# Altium project Brushless_motor_driver.PrjPcb
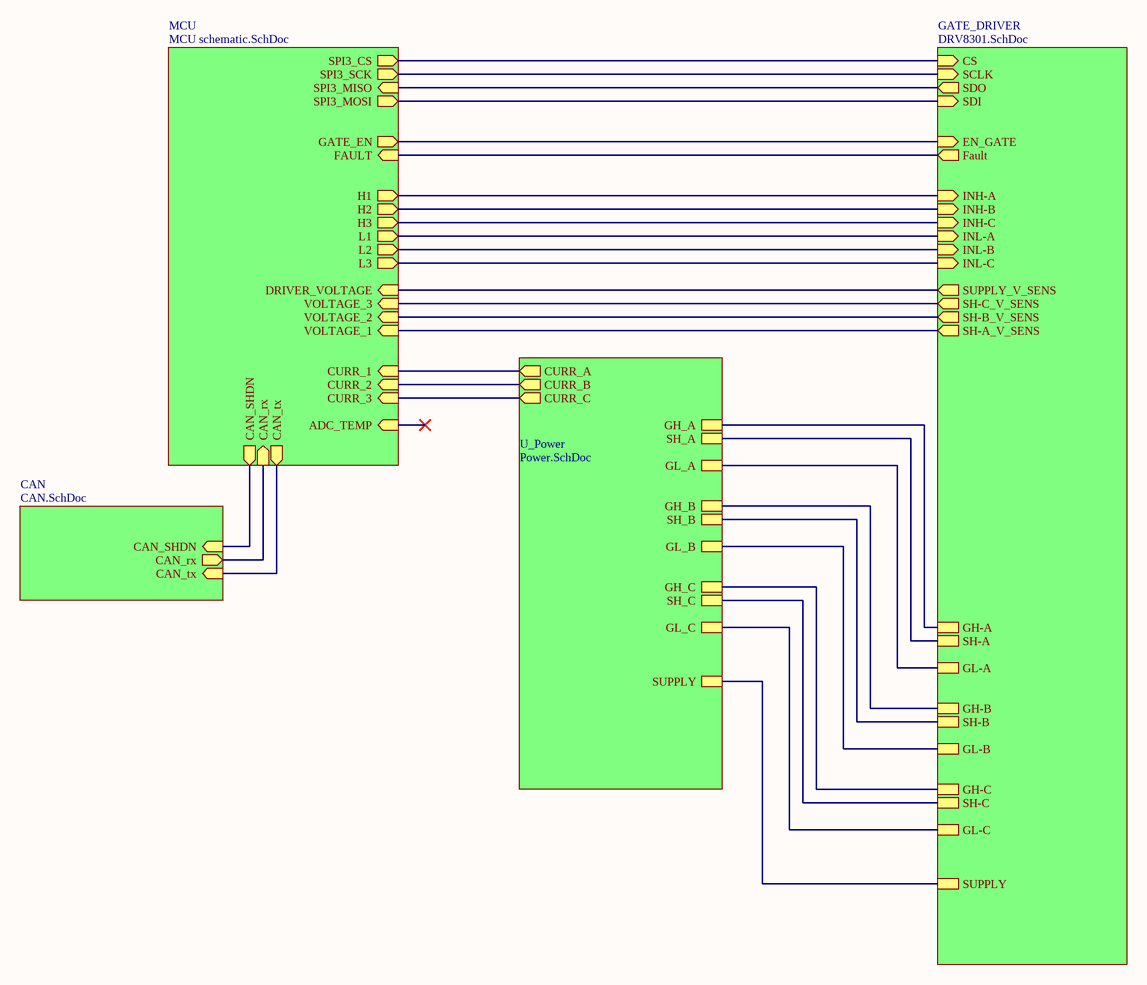
[diagram p0: Top_level.SchDoc]
5 sheets, 115 parts. Net scope: hierarchical (ports join the sheet entries above them; power ports are global).
Board file: brushless_motor_driver_PCB.PcbDoc
Sheets:
  Top_level.SchDoc
    CAN = CAN.SchDoc
    U_Power = Power.SchDoc
    MCU = MCU schematic.SchDoc
    GATE_DRIVER = DRV8301.SchDoc

## Sheet Top_level.SchDoc
size A3; SheetNumber: 1; SheetTotal: 5

### Sub-sheets
CAN = CAN.SchDoc: CAN_tx (in), CAN_rx (out), CAN_SHDN (in)
GATE_DRIVER = DRV8301.SchDoc: Fault (out), CS (in), SDI (in), SDO (out), SCLK (in), EN_GATE (in), INH-A (in), INL-A (in), INH-B (in), INL-B (in), INH-C (in), INL-C (in), SUPPLY, SH-A_V_SENS (out), SH-B_V_SENS (out), SH-C_V_SENS (out), SUPPLY_V_SENS (out), GL-C, GL-A, GH-B, SH-B, GL-B, GH-C, SH-C, GH-A, SH-A
MCU = MCU schematic.SchDoc: CAN_tx (out), CAN_rx (in), SPI3_SCK (out), SPI3_MISO (in), SPI3_MOSI (out), SPI3_CS (out), ADC_TEMP (in), CAN_SHDN (out), GATE_EN (out), FAULT (in), H1 (out), H2 (out), H3 (out), L1 (out), L2 (out), L3 (out), CURR_1 (in), CURR_2 (in), CURR_3 (in), VOLTAGE_1 (in), VOLTAGE_2 (in), VOLTAGE_3 (in), DRIVER_VOLTAGE (in)
U_Power = Power.SchDoc: GH_A, SH_A, GL_A, GH_B, GH_C, GL_B, GL_C, SH_B, SH_C, CURR_A (out), CURR_B (out), CURR_C (out), SUPPLY

### Nets
GH_A_net: sheet U_Power/GH_A, sheet GATE_DRIVER/GH-A
GH_B_net: sheet U_Power/GH_B, sheet GATE_DRIVER/GH-B
GH_C_net: sheet U_Power/GH_C, sheet GATE_DRIVER/GH-C
GL_A_net: sheet U_Power/GL_A, sheet GATE_DRIVER/GL-A
GL_B_net: sheet U_Power/GL_B, sheet GATE_DRIVER/GL-B
GL_C_net: sheet U_Power/GL_C, sheet GATE_DRIVER/GL-C
SPI_CS: sheet MCU/SPI3_CS, sheet GATE_DRIVER/CS
SPI_SCLK: sheet MCU/SPI3_SCK, sheet GATE_DRIVER/SCLK
SPI_SDI: sheet MCU/SPI3_MOSI, sheet GATE_DRIVER/SDI
SPI_SDO: sheet MCU/SPI3_MISO, sheet GATE_DRIVER/SDO
SUPPLY_NET: sheet U_Power/SUPPLY, sheet GATE_DRIVER/SUPPLY
NetC20_2: sheet U_Power/SH_A, sheet GATE_DRIVER/SH-A
NetC21_2: sheet U_Power/SH_B, sheet GATE_DRIVER/SH-B
NetC22_2: sheet U_Power/SH_C, sheet GATE_DRIVER/SH-C
NetC29_1: sheet U_Power/CURR_A, sheet MCU/CURR_1
NetC30_1: sheet U_Power/CURR_B, sheet MCU/CURR_2
NetC31_1: sheet U_Power/CURR_C, sheet MCU/CURR_3
NetR4_1: sheet CAN/CAN_tx, sheet MCU/CAN_tx
NetR5_1: sheet CAN/CAN_rx, sheet MCU/CAN_rx
NetR8_1: sheet CAN/CAN_SHDN, sheet MCU/CAN_SHDN
NetR13_1: sheet MCU/FAULT, sheet GATE_DRIVER/Fault
NetR24_2: sheet MCU/DRIVER_VOLTAGE, sheet GATE_DRIVER/SUPPLY_V_SENS
NetR26_2: sheet MCU/VOLTAGE_1, sheet GATE_DRIVER/SH-A_V_SENS
NetR28_2: sheet MCU/VOLTAGE_2, sheet GATE_DRIVER/SH-B_V_SENS
NetR30_2: sheet MCU/VOLTAGE_3, sheet GATE_DRIVER/SH-C_V_SENS
NetU1_82: sheet MCU/H1, sheet GATE_DRIVER/INH-A
NetU1_83: sheet MCU/H2, sheet GATE_DRIVER/INH-B
NetU1_84: sheet MCU/H3, sheet GATE_DRIVER/INH-C
NetU1_85: sheet MCU/L1, sheet GATE_DRIVER/INL-A
NetU1_86: sheet MCU/L2, sheet GATE_DRIVER/INL-B
NetU1_87: sheet MCU/L3, sheet GATE_DRIVER/INL-C
NetU1_88: sheet MCU/GATE_EN, sheet GATE_DRIVER/EN_GATE

## Sheet CAN.SchDoc
size A; SheetNumber: 3; SheetTotal: 5
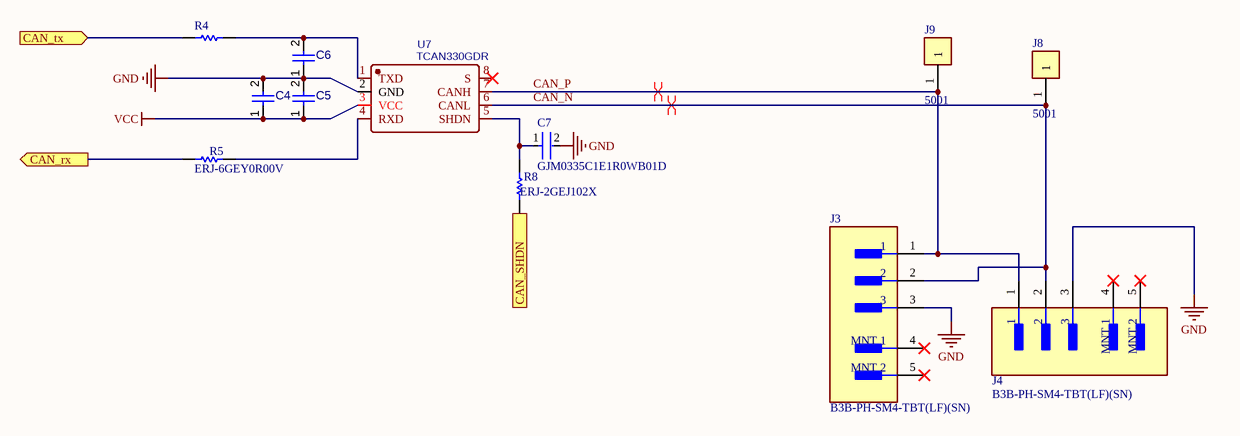
[diagram p1: CAN.SchDoc]

### Parts
C4  KGM15CR71C105JT  [CAP-0603]  (value not drawn)
C5  KGM15CR71C105JT  [CAP-0603]  (value not drawn)
C6  KGM15CR71C105JT  [CAP-0603]  (value not drawn)
C7  GJM0335C1E1R0WB01D  [FP-GJM033-0_03-IPC_A]
J3  B3B-PH-SM4-TBT(LF)(SN)  [FP-B3B-PH-SM4-TBT_LF_SN-MFG]
J4  B3B-PH-SM4-TBT(LF)(SN)  [FP-B3B-PH-SM4-TBT_LF_SN-MFG]
J8  5001  [FP-5001-MFG]
J9  5001  [FP-5001-MFG]
R4  ERJ-6GEY0R00V  [RESC2013X70X40NL20T20]  (value not drawn)
R5  ERJ-6GEY0R00V  [RESC2013X70X40NL20T20]
R8  ERJ-2GEJ102X  [RESC1005X40X25NL05T05]
U7  TCAN330GDR  [IC-BUCK-8SOIC]

### Ports
CAN_rx (out), CAN_SHDN (in), CAN_tx (in)

### Nets
GND: C4.2 C5.2 C6.1 C7.2 J3.3 J4.3 U7.2(GND)
VCC: C4.1 C5.1 U7.3(VCC)
CAN_N: J3.2 J4.2 J8.1 U7.6(CANL)  [project net CAN_N_3]
CAN_P: J3.1 J4.1 J9.1 U7.7(CANH)  [project net CAN_P_3]
NetC6_2: C6.2 R4.2 U7.1(TXD)
NetC7_1: C7.1 R8.2 U7.5(SHDN)
NetR4_1: R4.1 ; port CAN_tx
NetR5_1: R5.1 ; port CAN_rx
NetR5_2: R5.2 U7.4(RXD)
NetR8_1: R8.1 ; port CAN_SHDN

Not connected (* = marked no-connect by the designer): J3 4(MNT_1)* 5(MNT_2)*; J4 4(MNT_1)* 5(MNT_2)*; U7 8(S)*

### Layout directives
differential pair: CAN_N_3, CAN_P_3

### Library data of the parts
C4-C6 = CMP-001-00090-1: Cap Cer 1UF 16V X7R 0603
C7 = CMP-2010-00803-2: Ceramic Capacitor 1pF ±0.05pF 25V C0G 0201 (0603 Metric); Packaging: Tape and Reel; Lead Free: Lead Free; Voltage Rating (DC): 25V; Termination: SMD/SMT; Capacitance: 1pF; Height: 0.3mm; Case Code (Imperial): 0201; Thickness: 0.013inch; Max Operating Temperature: 125°C; Length: 0.6mm; Case/Package: 0201; Voltage Rating: 25V; Case Code (Metric): 0603; Radiation Hardening: No; Width: 0.3mm; Min Operating Temperature: -55°C; Mount: Surface Mount; Package Quantity: 15000; Depth: 0.3mm; Dielectric: C0G
J3 J4 = CMP-17439-000306-1: CONN HEADER SMD 3POS 2MM; Contact Resistance: 20mR; Max Voltage Rating (AC): 100V; Number of Positions: 3; Pitch: 0.079inch; Mated Stacking Heights: 8.6mm; Max Current Rating: 2A; Fastening Type: Detent; Max Operating Temperature: 85°C; Termination: Solder; Mount: Surface Mount; Contact Finish - Mating: TIN; Min Operating Temperature: -25°C; Housing Color: Beige; Packaging: Tape and Reel; Insulation Color: Natural; Length: 9.95mm; Flammability Rating: UL94 V-0; Connector Type: Header; Contact Material: Copper Alloy; Insulation Material: Nylon; Lead Free: Lead Free; Contact Plating: Tin; Contact Shape: Square; Number of Rows: 1; Color: Natural; Package Quantity: 10; Depth: 5mm; Voltage Rating: 100V; Housing Material: Polyamide; Contact Type: Male Pin; Series: PH; Orientation: Straight; Contact Mating Length: 0.13inch
J8 J9 = CMP-2000-05181-2: PC TEST POINT MINIATURE BLACK; Body Material: Bronze; Plating: Silver; Inside Diameter: 1.27mm; Hole Diameter: 1.6mm; Number of Ports: 1; Outside Diameter: 2.54mm; Insulation: Insulated; Insulation Material: Nylon; Mount: Through Hole; RoHS Compliant: Yes; Series: THM; Height: 0.3inch; Termination: Through Hole; Material: Nylon; Packaging: Bulk; Contact Material: Bronze; REACH SVHC: No SVHC; Contact Plating: Silver; Orientation: Straight; Lead Free: Lead Free; Package Quantity: 100; Length: 7.62mm; Flammability Rating: UL94 V-0; Number of Contacts: 1; Diameter: 2.54mm; Housing Color: Black; Color: Black
R4 R5 = CMP-1665-00002-5: Chip Resistor, 0 Ohm, +/- 1%, 0.125 W, -55 to 155 degC, 0805 (2012 Metric), RoHS, Tape and Reel; Tolerance: 5%; Resistance: 0 Ohm; REACH SVHC: No SVHC; Min Operating Temperature: -55 degC; Case/Package: 0805; Packaging: Tape and Reel; Package Quantity: 5000; ComponentLink1Description: Manufacturer URL; PackageDescription: 2-Pin Surface Mount Device, Body 2 x 1.25 mm; Mounting Technology: Surface Mount; Max Operating Temperature: 155 degC; PartNumber: ERJ-6GEY0R00V; Width: 1.25 mm; RoHSCompliant: True; Height: 0.6 mm; ComponentLink1URL: http://www.panasonic.com/; ComponentLink2URL: http://industrial.panasonic.com/cdbs/www-data/pdf/RDA0000/AOA0000C84.pdf; Case Code (Imperial): 0805; DatasheetVersion: 03/2015; Length: 2 mm; Case Code (Metric): 2012; ComponentLink2Description: Datasheet; Radiation Hardening: No
R8 = CMP-2002-00432-1: Manufacturer: Panasonic; Part Number: ERJ-2GEJ102X
U7 = TCAN330GDR: BOM_Manufacturer: TI(德州仪器); Contributor: LCSC; BOM_Supplier: LCSC; BOM_Supplier Part: C191009; BOM_Manufacturer Part: TCAN330GDR; BOM_JLCPCB Part Class: Extended Part; spicePre: U; spiceSymbolName: TCAN330GDR

## Sheet Power.SchDoc
size A3; SheetNumber: 5; SheetTotal: 5
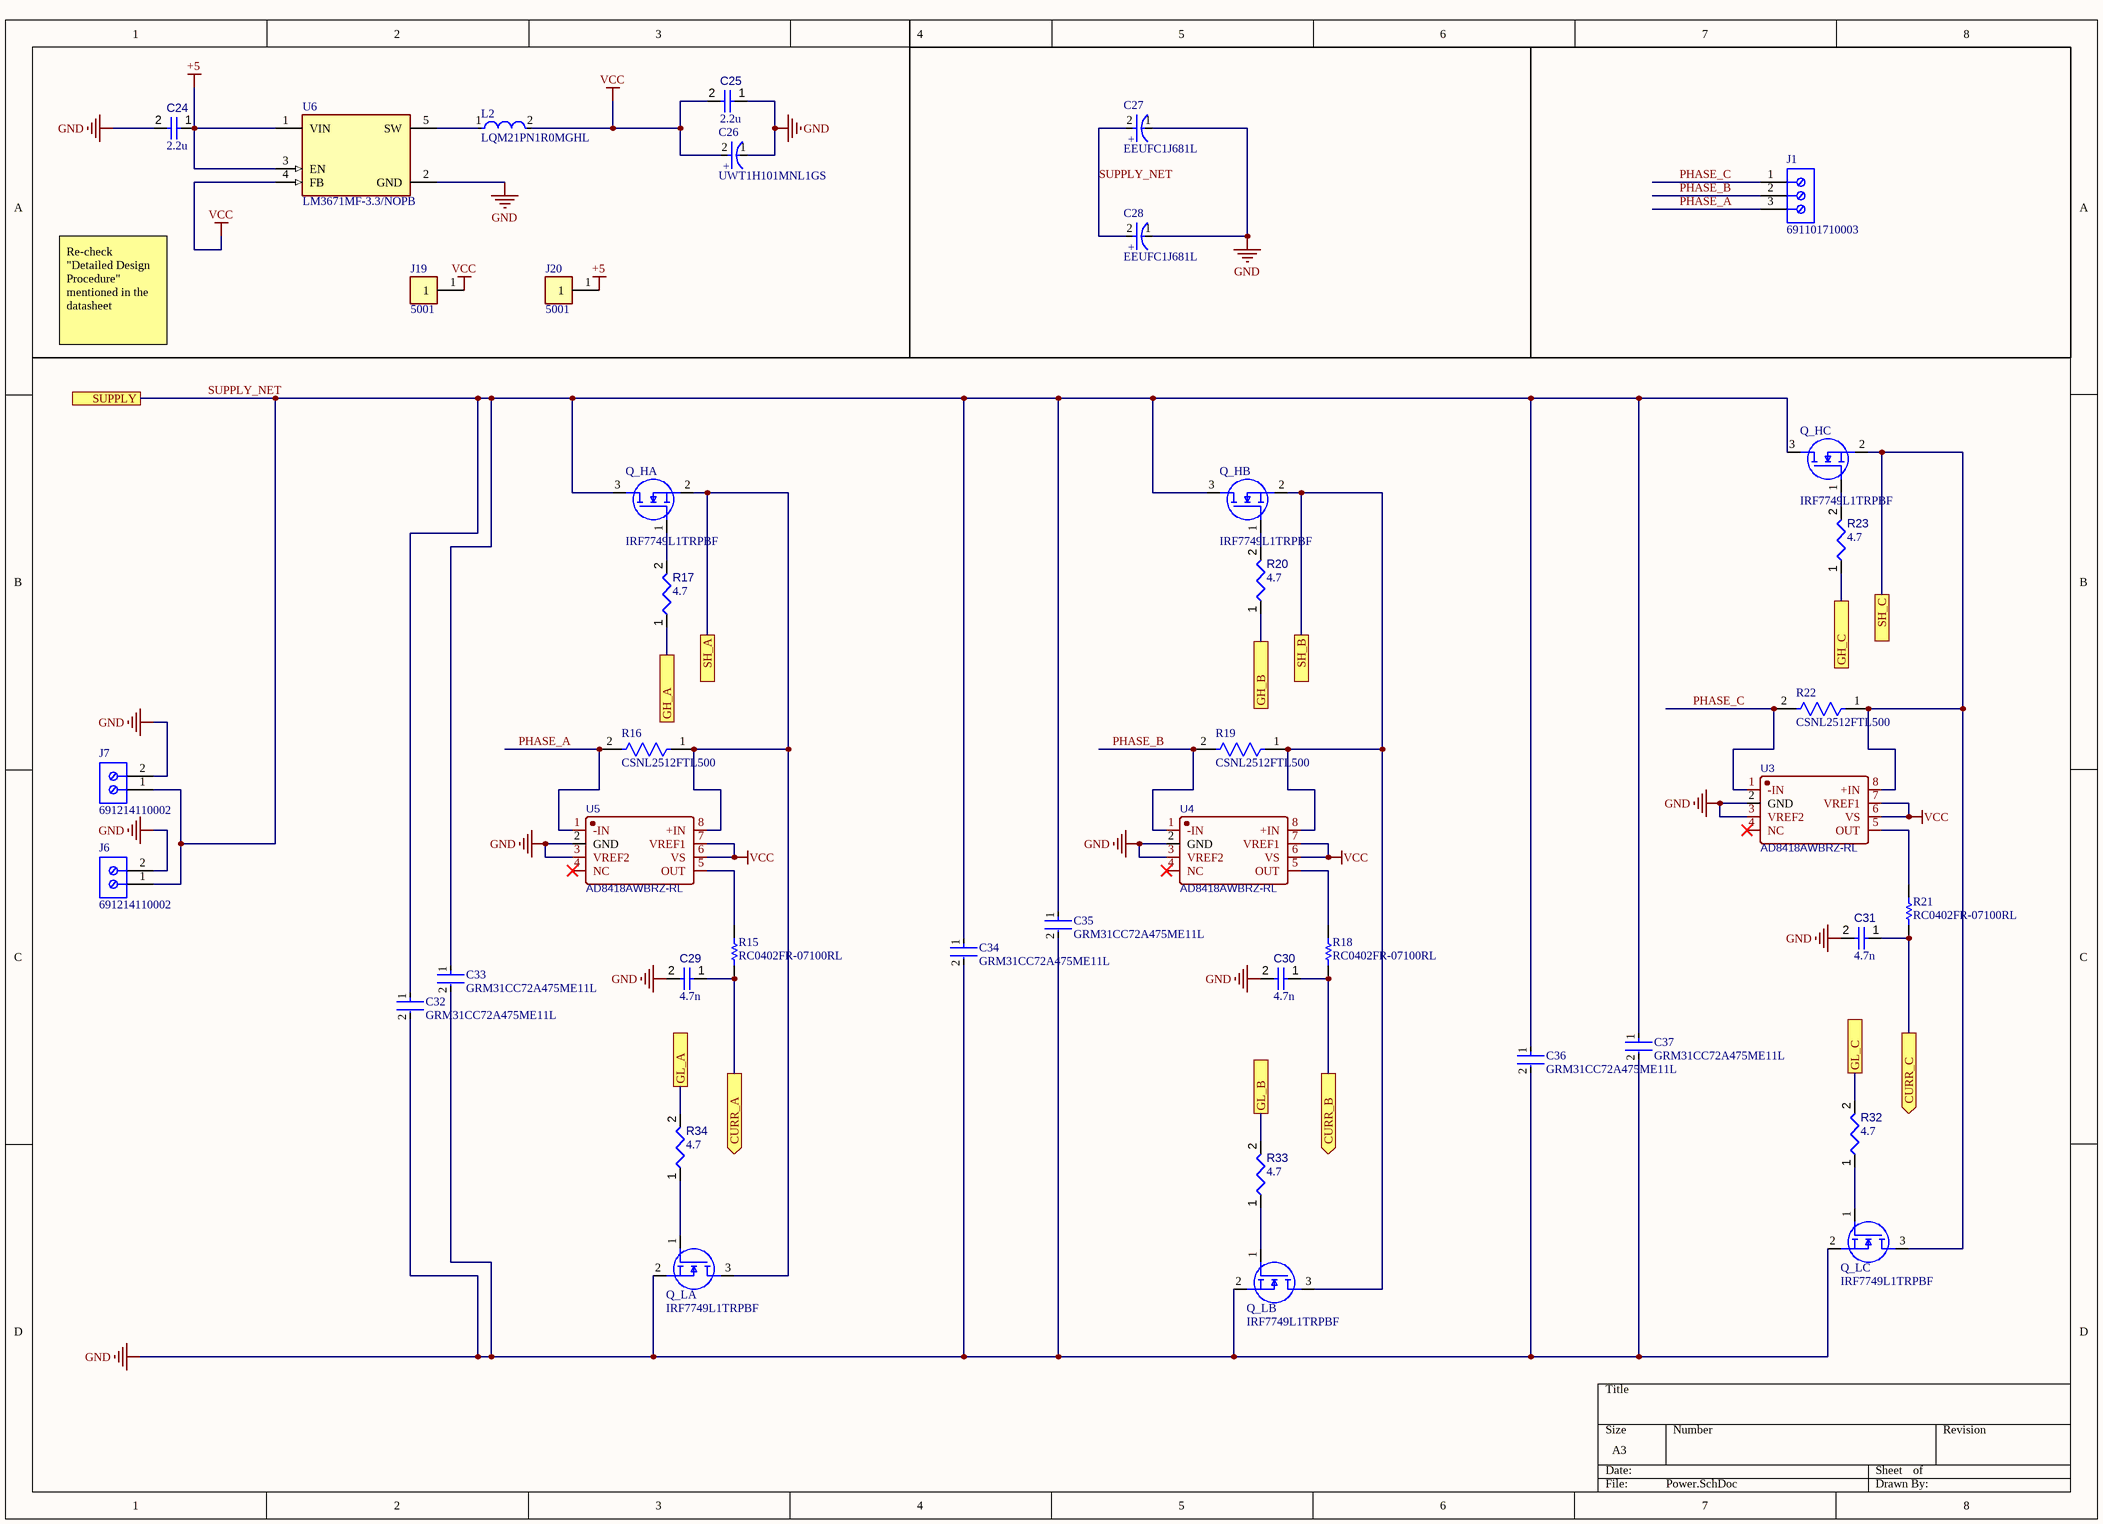
[diagram p2: Power.SchDoc]

### Parts
C24  value 2.2u  [CAP-0805]  (hidden comment: C0805C225J4REC7800)
C25  value 2.2u  [CAP-0805]  (hidden comment: C0805C225J4REC7800)
C26  UWT1H101MNL1GS  [FP-UWT1H101MNL1GS-MFG]
C27  EEUFC1J681L  [FP-EEUFC1J681L-MFG]
C28  EEUFC1J681L  [FP-EEUFC1J681L-MFG]
C29  value 4.7n  [CAP-0402]  (hidden comment: C0402C472K4RECAUTO)
C30  value 4.7n  [CAP-0402]  (hidden comment: C0402C472K4RECAUTO)
C31  value 4.7n  [CAP-0402]  (hidden comment: C0402C472K4RECAUTO)
C32  GRM31CC72A475ME11L  [FP-GRM31C-0_3-e0_3_0_9-MFG]
C33  GRM31CC72A475ME11L  [FP-GRM31C-0_3-e0_3_0_9-MFG]
C34  GRM31CC72A475ME11L  [FP-GRM31C-0_3-e0_3_0_9-MFG]
C35  GRM31CC72A475ME11L  [FP-GRM31C-0_3-e0_3_0_9-MFG]
C36  GRM31CC72A475ME11L  [FP-GRM31C-0_3-e0_3_0_9-MFG]
C37  GRM31CC72A475ME11L  [FP-GRM31C-0_3-e0_3_0_9-MFG]
J1  691101710003  [691101710003]
J6  691214110002  [691214110002]
J7  691214110002  [691214110002]
J19  5001  [FP-5001-MFG]
J20  5001  [FP-5001-MFG]
L2  LQM21PN1R0MGHL  [FP-LQM21PH_G0-MFG]
Q_HA  IRF7749L1TRPBF  [IC-MOSFET-DirectFET]
Q_HB  IRF7749L1TRPBF  [IC-MOSFET-DirectFET]
Q_HC  IRF7749L1TRPBF  [IC-MOSFET-DirectFET]
Q_LA  IRF7749L1TRPBF  [IC-MOSFET-DirectFET]
Q_LB  IRF7749L1TRPBF  [IC-MOSFET-DirectFET]
Q_LC  IRF7749L1TRPBF  [IC-MOSFET-DirectFET]
R15  RC0402FR-07100RL  [RESC1005X40X25ML05T10]
R16  CSNL2512FTL500  [FP-CSNL2512FTL500-MFG]
R17  value 4.7  [RES-0603]  (hidden comment: CRCW06034R70JNEAHP)
R18  RC0402FR-07100RL  [RESC1005X40X25ML05T10]
R19  CSNL2512FTL500  [FP-CSNL2512FTL500-MFG]
R20  value 4.7  [RES-0603]  (hidden comment: CRCW06034R70JNEAHP)
R21  RC0402FR-07100RL  [RESC1005X40X25ML05T10]
R22  CSNL2512FTL500  [FP-CSNL2512FTL500-MFG]
R23  value 4.7  [RES-0603]  (hidden comment: CRCW06034R70JNEAHP)
R32  value 4.7  [RES-0603]  (hidden comment: CRCW06034R70JNEAHP)
R33  value 4.7  [RES-0603]  (hidden comment: CRCW06034R70JNEAHP)
R34  value 4.7  [RES-0603]  (hidden comment: CRCW06034R70JNEAHP)
U3  AD8418AWBRZ-RL  [IC-SOIC8]
U4  AD8418AWBRZ-RL  [IC-SOIC8]
U5  AD8418AWBRZ-RL  [IC-SOIC8]
U6  LM3671MF-3.3/NOPB  [FP-DBV0005A-IPC_C]

### Ports
CURR_A (out), CURR_B (out), CURR_C (out), GH_A, GH_B, GH_C, GL_A, GL_B, GL_C, SH_A, SH_B, SH_C, SUPPLY

### Nets
+5: C24.1 J20.1 U6.1(VIN) U6.3(EN)
GND: C24.2 C25.1 C26.1(C) C27.1(C) C28.1(C) C29.2 C30.2 C31.2 C32.2 C33.2 C34.2 C35.2 C36.2 C37.2 J6.2 J7.2 Q_LA.2(S) Q_LB.2(S) Q_LC.2(S) U3.2(GND) U3.3(VREF2) U4.2(GND) U4.3(VREF2) U5.2(GND) U5.3(VREF2) U6.2(GND)
VCC: C25.2 C26.2(A) J19.1 L2.2 U3.6(VS) U3.7(VREF1) U4.6(VS) U4.7(VREF1) U5.6(VS) U5.7(VREF1) U6.4(FB)
GH_A_net: R17.1 ; port GH_A
GH_B_net: R20.1 ; port GH_B
GH_C_net: R23.1 ; port GH_C
GL_A_net: R34.2 ; port GL_A
GL_B_net: R33.2 ; port GL_B
GL_C_net: R32.2 ; port GL_C
PHASE_A: J1.3 R16.2 U5.1(-IN)  [project net PHASE_A_5]
PHASE_B: J1.2 R19.2 U4.1(-IN)  [project net PHASE_B_5]
PHASE_C: J1.1 R22.2 U3.1(-IN)  [project net PHASE_C_5]
SUPPLY_NET: C27.2(A) C28.2(A) C32.1 C33.1 C34.1 C35.1 C36.1 C37.1 J6.1 J7.1 Q_HA.3(D) Q_HB.3(D) Q_HC.3(D) ; port SUPPLY
NetC20_2: Q_HA.2(S) Q_LA.3(D) R16.1 U5.8(+IN) ; port SH_A
NetC21_2: Q_HB.2(S) Q_LB.3(D) R19.1 U4.8(+IN) ; port SH_B
NetC22_2: Q_HC.2(S) Q_LC.3(D) R22.1 U3.8(+IN) ; port SH_C
NetC29_1: C29.1 R15.1 ; port CURR_A
NetC30_1: C30.1 R18.1 ; port CURR_B
NetC31_1: C31.1 R21.1 ; port CURR_C
NetL2_1: L2.1 U6.5(SW)
NetQ_HA_1: Q_HA.1(G) R17.2
NetQ_HB_1: Q_HB.1(G) R20.2
NetQ_HC_1: Q_HC.1(G) R23.2
NetQ_LA_1: Q_LA.1(G) R34.1
NetQ_LB_1: Q_LB.1(G) R33.1
NetQ_LC_1: Q_LC.1(G) R32.1
NetR15_2: R15.2 U5.5(OUT)
NetR18_2: R18.2 U4.5(OUT)
NetR21_2: R21.2 U3.5(OUT)

Not connected (* = marked no-connect by the designer): U3 4(NC)*; U4 4(NC)*; U5 4(NC)*

### Notes on the sheet
- Re-check "Detailed Design Procedure" mentioned in the datasheet
- (in symbol CMP-2000-07373-2) +
- (in symbol CMP-05427-000007-1) +

### Library data of the parts
C24 C25 = CMP-001-00084-1: ESD SMD Comm X7R 0805 (2012Metric) Ceramic Capacitor 0.079Lx0.049W 2.00mmx1.25mm X7R ±5% 2.2muF
C26 = CMP-2000-07373-2: CAP ALUM 100UF 20% 50V SMD; Leakage Current: 3uA; Ripple Current: 140mA; Life (Hours): 1000Hour; Dissipation Factor: 0.14%; Dielectric Material: Aluminium; Termination: SMD/SMT; Tolerance: 20%; Package Quantity: 500; Capacitance: 100uF; Height: 10mm; REACH SVHC: No SVHC; Case/Package: Radial; Series: WT; Diameter: 8mm; Voltage Rating: 50V; Construction: Cylindrical; Length: 10mm; Min Operating Temperature: -55°C; Max Operating Temperature: 105°C; Voltage Rating (DC): 50V; Packaging: Tape and Reel; Voltage: 50V; Mount: Surface Mount; Ripple Current (AC): 140mA; Radiation Hardening: No; Number of Pins: 2; Lead Free: Lead Free; Height - Seated (Max): 0.413inch; RoHS Compliant: Yes
C27 C28 = CMP-05427-000007-1: CAP ALUM 680UF 20% 63V RADIAL; Manufacturer: Panasonic; Ripple Current: 2265mA; Material: Aluminum; Life: 5000Hours; Automotive Grade: Grade 2; Leakage Current: 428.4uA; Dissipation Factor: 8%; ComponentLink2Description: Datasheet; ComponentLink2URL: https://industrial.panasonic.com/cdbs/www-data/pdf/RDF0000/ABA0000C1209.pdf; Temperature: -55°C to +105°C; Ipc Land Pattern Name: CAPRD500W100D1300H3700; Octopart: https://octopart.com/eeu-fc1j681l-panasonic-39478579; Tolerance: 20%; Voltage Rating: 63V; Category: Cap; Device Class L3: Aluminum Electrolytic Capacitors; Device Class L1: Passive Components; Package: 0; Value: 680uF; Mouser Description: Aluminum Electrolytic Capacitors - Leaded 680uF 63V; Height: 37mm; Automotive: Yes; Digikey Description: CAP ALUM 680UF 20% 63V RADIAL; Device Class L2: Capacitors; Temperature Range High: +105°C; Temperature Range Low: -55°C; RoHS: TRUE; Lead Free: Yes; Capacitance: 680uF; Manufacturer Part Number: EEUFC1J681L
C29-C31 = CMP-001-00083-1: Ceramic Capacitor, Multilayer, Ceramic, 16V, 10% +Tol, 10% -Tol, X7R, 15% TC, 0.0047uF, Surface Mount, 0402; RoHS Compliant: Yes; Capacitor Type: Ceramic; Pins: 2
C32-C37 = CMP-06035-061964-2: Chip Multilayer Ceramic Capacitors for General Purpose, 1206, 4.7uF, X7S, 22%, 20%, 100V; RoHS Compliant: Yes
J1 = CMP-1502-03257-2: NexarPartId: 8917705; Voltage Rating: 250V; Current: 16A; Wire Gauge (Min): 14AWG; Pitch: 5.0038mm; Wire Gauge (Max): 26AWG; Number of Positions Per Level: 3; Plating: Steel; Number of Levels: 1; Stripping Length: -7mm; REACH SVHC: Unknown; Width: 16.2mm; Height: 16.4mm; Contact Material: Brass; RoHS: Compliant; Color: Blue; Contact Plating: Tin; Lead Pitch: 5mm; Packaging: Box; Termination: Screw; Number of Contacts: 3; Wire/Cable Gauge: 26AWG; Min Operating Temperature: -40°C; Max Operating Temperature: 105°C; Housing Material: Nylon; Length: 9mm; Voltage: 250V; Mount: Through Hole; Current Rating: 16A; Number of Pins: 3
J6 J7 = CMP-1502-02464-2: NexarPartId: 18818288; Plating: Brass, Steel; Current: 10A; Pitch: 3.5052mm; Number of Levels: 1; Number of Contacts: 2; Wire Gauge (Min): 16AWG; Voltage: 300V; Wire Gauge (Max): 24AWG; Stripping Length: -6mm; Number of Pins: 2; Number of Rows: 1; REACH SVHC: Unknown; RoHS: Compliant; Housing Material: Nylon; Termination: Screw; Mount: Through Hole; Contact Plating: Brass, Tin; Number of Positions Per Level: 2; Color: Blue, Green; Width: 7.9mm; Voltage Rating: 300V; Length: 7.4mm; Current Rating: 10A; Wire/Cable Gauge: 24AWG; Packaging: Box; Max Operating Temperature: 105°C; Lead Pitch: 3.5mm; Height: 8.7mm; Contact Material: Brass; Min Operating Temperature: -40°C
J19 J20 = CMP-2000-05181-2: as J8 on sheet CAN; Insulation Material: Nylon; Mount: Through Hole; RoHS Compliant: Yes; Series: THM; Height: 0.3inch; Termination: Through Hole; Material: Nylon; Packaging: Bulk; Contact Material: Bronze; REACH SVHC: No SVHC; Contact Plating: Silver; Orientation: Straight; Lead Free: Lead Free; Package Quantity: 100; Length: 7.62mm; Flammability Rating: UL94 V-0; Number of Contacts: 1; Diameter: 2.54mm; Housing Color: Black; Color: Black
L2 = CMP-06042-016504-1: Multilayer Type Inductor for Power Lines, 0805 (2012), 1μH, 20%, 0.1Ω, 2A; Saturation Current: 1.1A; Current Rating: 1.7A; Inductance: 1uH; Core Material: Ferrite; Self Resonant Frequency: 60MHz; Shielding: Shielded; DC Resistance (DCR): 100mR; Test Frequency: 1MHz; Length: 0.079inch; Mount: Surface Mount; Case Code (Imperial): 0805; Max DC Current: 1.7A; Packaging: Tape and Reel; Height - Seated (Max): 0.039inch; Case Code (Metric): 2012; Min Operating Temperature: -40°C; Width: 0.049inch; Tolerance: 20%; Height: 0.9mm; Package Quantity: 3000; Lead Free: Lead Free; Case/Package: 0805; RoHS Compliant: Yes; Weight: 0.000194oz; Termination: SMD/SMT; Max Operating Temperature: 85°C
Q_HA Q_HB Q_HC Q_LA Q_LB Q_LC = CMP-013-00039-8: Power Field-Effect Transistor, 375A I(D), 1-Element, N-Channel, Metal-oxide Semiconductor FET; pin to pad: 2>2+3+4+5+6+7+8+9 3>10+11+12+13+14+15; RoHS Compliant: Yes; Max Operating Temperature: 175°C
R15 R18 R21 = CMP-2002-07344-1: Manufacturer: Yageo / Phycomp; Part Number: RC0402FR-07100RL
R16 R19 R22 = CMP-26527-007622-1: RES 500 UOHM 1% 2W 2512; Resistance: 0.5mR; Temperature Coefficient: 50ppm/°C; Tolerance: 1%; Radiation Hardening: No; Case Code (Imperial): 2512; Width: 0.125inch; Depth: 3.18mm; Max Operating Temperature: 170°C; Number of Terminations: 2; Lead Free: Lead Free; Contact Plating: Tin; Size Code: 2512; Packaging: Tape and Reel; Mount: Surface Mount; Case/Package: 2512; Length: 0.25inch; Max Power Dissipation: 2W; Height: 0.057inch; RoHS Compliant: Yes; Series: CSNL; Construction: Rectangular; Features: Moisture Resistant; Resistor Type: Metal Foil; Power Rating: 2W; Min Operating Temperature: -55°C; Case Code (Metric): 6432; Military Standard: Not
R17 R20 R23 R32-R34 = CMP-009-00180-1: Fixed Resistor, Metal Glaze/thick Film, 0.33W, 4.7ohm, 75V, 5% +/-Tol, 200ppm/Cel, Surface Mount, 0603; Power: 250mW; Case/Package: 0603; Max Operating Temperature: 155°C; Pins: 2; Tolerance: 5%; RoHS Compliant: Yes; Min Operating Temperature: -55°C; Mounting Technology: Surface Mount
U3-U5 = AD8418AWBRZ-RL: Manufacturer: Analog Devices; Contributor: LCSC; Supplier: LCSC; Supplier Part: C462197; Manufacturer Part: AD8418AWBRZ-RL; JLCPCB Part Class: Extended Part; spicePre: U; spiceSymbolName: AD8418AWBRZ-RL
U6 = CMP-0063-01132-4: IC REG BUCK 3.3V 600MA SOT23-5; Number of Outputs: 1; Min Supply Voltage: 2.7V; Frequency: 2MHz; Min Output Voltage: 1.1V; Max Supply Voltage: 5.5V; Output Type: Fixed; Switching Frequency: 2.6MHz; Quiescent Current: 16uA; Case/Package: SOT-23; Number of Pins: 5; Lead Free: Lead Free; Min Operating Temperature: -40°C; Length: 2.92mm; Packaging: Tape and Reel; Max Output Current: 600mA; Height: 1.02mm; Max Operating Temperature: 85°C; Mount: Surface Mount; REACH SVHC: No SVHC; Contact Plating: Tin; Output Current: 600mA; Min Input Voltage: 2.7V; RoHS Compliant: Yes; Output Voltage: 3.3V; Package Quantity: 1000; Max Output Voltage: 3.3V; Nominal Output Voltage: 3.3V; Width: 1.6mm; Max Input Voltage: 5.5V; Termination: SMD/SMT

## Sheet MCU schematic.SchDoc
size A3; SheetNumber: 2; SheetTotal: 5
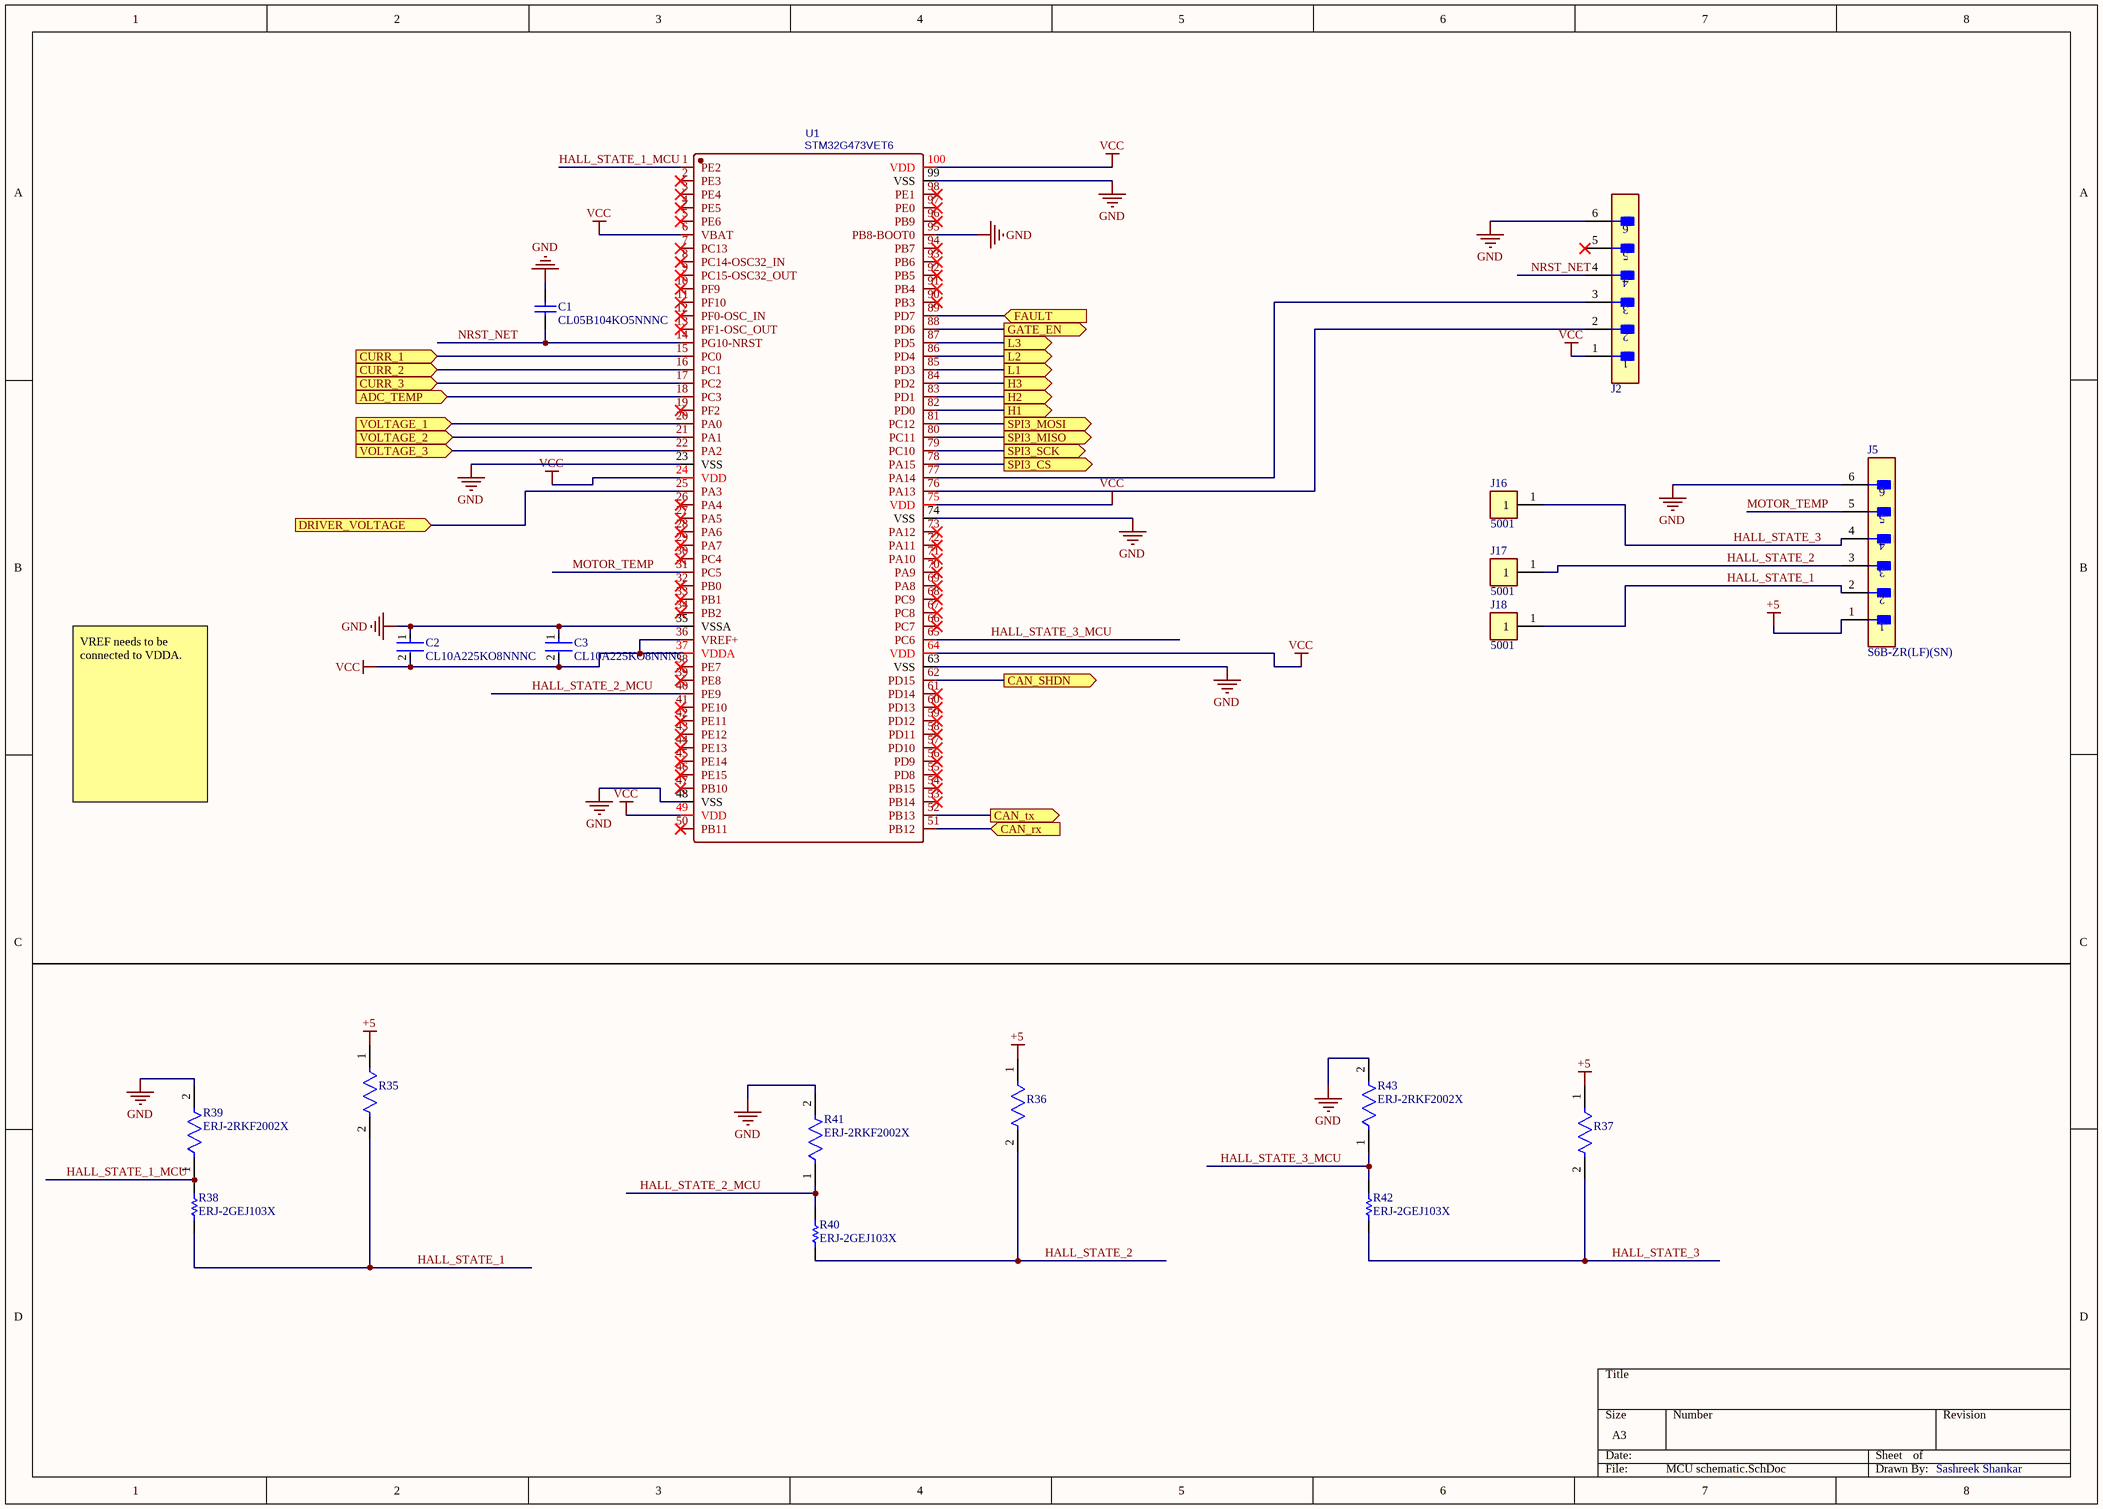
[diagram p3: MCU schematic.SchDoc]

### Parts
C1  CL05B104KO5NNNC  [CAPC1050X55X23ML05T13]
C2  CL10A225KO8NNNC  [FP-CL10-IPC_A]
C3  CL10A225KO8NNNC  [FP-CL10-IPC_A]
J2  S6B-ZR(LF)(SN)  [FP-S6B-ZR_LF_SN-MFG]  (value not drawn)
J5  S6B-ZR(LF)(SN)  [FP-S6B-ZR_LF_SN-MFG]
J16  5001  [FP-5001-MFG]
J17  5001  [FP-5001-MFG]
J18  5001  [FP-5001-MFG]
R35  ERA-2AEB332X  [FP-ERA2A-MFG]  (value not drawn)
R36  ERA-2AEB332X  [FP-ERA2A-MFG]  (value not drawn)
R37  ERA-2AEB332X  [FP-ERA2A-MFG]  (value not drawn)
R38  ERJ-2GEJ103X  [RESC1005X40X25ML05T05]
R39  ERJ-2RKF2002X  [FP-ERJ2RK-MFG]
R40  ERJ-2GEJ103X  [RESC1005X40X25ML05T05]
R41  ERJ-2RKF2002X  [FP-ERJ2RK-MFG]
R42  ERJ-2GEJ103X  [RESC1005X40X25ML05T05]
R43  ERJ-2RKF2002X  [FP-ERJ2RK-MFG]
U1  STM32G473VET6  [MCU-LQFP100]

### Ports
ADC_TEMP (in), CAN_rx (in), CAN_SHDN (out), CAN_tx (out), CURR_1 (in), CURR_2 (in), CURR_3 (in), DRIVER_VOLTAGE (in), FAULT (in), GATE_EN (out), H1 (out), H2 (out), H3 (out), L1 (out), L2 (out), L3 (out), SPI3_CS (out), SPI3_MISO (out), SPI3_MOSI (out), SPI3_SCK (out), VOLTAGE_1 (in), VOLTAGE_2 (in), VOLTAGE_3 (in)

### Nets
+5: J5.1 R35.1 R36.1 R37.1
GND: C1.2 C2.1 C3.1 J2.6 J5.6 R39.2 R41.2 R43.2 U1.23(VSS) U1.35(VSSA) U1.48(VSS) U1.63(VSS) U1.74(VSS) U1.95(PB8-BOOT0) U1.99(VSS)
VCC: C2.2 C3.2 J2.1 U1.6(VBAT) U1.24(VDD) U1.36(VREF+) U1.37(VDDA) U1.49(VDD) U1.64(VDD) U1.75(VDD) U1.100(VDD)
HALL_STATE_1: J5.2 J18.1 R35.2 R38.1  [project net HALL_STATE_1_2]
HALL_STATE_1_MCU: R38.2 R39.1 U1.1(PE2)  [project net HALL_STATE_1_MCU_2]
HALL_STATE_2: J5.3 J17.1 R36.2 R40.1  [project net HALL_STATE_2_2]
HALL_STATE_2_MCU: R40.2 R41.1 U1.40(PE9)  [project net HALL_STATE_2_MCU_2]
HALL_STATE_3: J5.4 J16.1 R37.2 R42.1  [project net HALL_STATE_3_2]
HALL_STATE_3_MCU: R42.2 R43.1 U1.65(PC6)  [project net HALL_STATE_3_MCU_2]
MOTOR_TEMP: J5.5 U1.31(PC5)  [project net MOTOR_TEMP_2]
NRST_NET: C1.1 J2.4 U1.14(PG10-NRST)  [project net NRST_NET_2]
SPI_CS: U1.78(PA15) ; port SPI3_CS
SPI_SCLK: U1.79(PC10) ; port SPI3_SCK
SPI_SDI: U1.81(PC12) ; port SPI3_MOSI
SPI_SDO: U1.80(PC11) ; port SPI3_MISO
NetC29_1: U1.15(PC0) ; port CURR_1
NetC30_1: U1.16(PC1) ; port CURR_2
NetC31_1: U1.17(PC2) ; port CURR_3
NetJ2_2: J2.2 U1.76(PA13)
NetJ2_3: J2.3 U1.77(PA14)
NetR4_1: U1.52(PB13) ; port CAN_tx
NetR5_1: U1.51(PB12) ; port CAN_rx
NetR8_1: U1.62(PD15) ; port CAN_SHDN
NetR13_1: U1.89(PD7) ; port FAULT
NetR24_2: U1.25(PA3) ; port DRIVER_VOLTAGE
NetR26_2: U1.20(PA0) ; port VOLTAGE_1
NetR28_2: U1.21(PA1) ; port VOLTAGE_2
NetR30_2: U1.22(PA2) ; port VOLTAGE_3
NetU1_18: U1.18(PC3) ; port ADC_TEMP
NetU1_82: U1.82(PD0) ; port H1
NetU1_83: U1.83(PD1) ; port H2
NetU1_84: U1.84(PD2) ; port H3
NetU1_85: U1.85(PD3) ; port L1
NetU1_86: U1.86(PD4) ; port L2
NetU1_87: U1.87(PD5) ; port L3
NetU1_88: U1.88(PD6) ; port GATE_EN

Not connected (* = marked no-connect by the designer): J2 5*; U1 2(PE3)* 3(PE4)* 4(PE5)* 5(PE6)* 7(PC13)* 8(PC14-OSC32_IN)* 9(PC15-OSC32_OUT)* 10(PF9)* 11(PF10)* 12(PF0-OSC_IN)* 13(PF1-OSC_OUT)* 19(PF2)* 26(PA4)* 27(PA5)* 28(PA6)* 29(PA7)* 30(PC4)* 32(PB0)* 33(PB1)* 34(PB2)* 38(PE7)* 39(PE8)* 41(PE10)* 42(PE11)* 43(PE12)* 44(PE13)* 45(PE14)* 46(PE15)* 47(PB10)* 50(PB11)* 53(PB14)* 54(PB15)* 55(PD8)* 56(PD9)* 57(PD10)* 58(PD11)* 59(PD12)* 60(PD13)* 61(PD14)* 66(PC7)* 67(PC8)* 68(PC9)* 69(PA8)* 70(PA9)* 71(PA10)* 72(PA11)* 73(PA12)* 90(PB3)* 91(PB4)* 92(PB5)* 93(PB6)* 94(PB7)* 96(PB9)* 97(PE0)* 98(PE1)*

### Notes on the sheet
- VREF needs to be connected to VDDA.
- Sashreek Shankar

### Library data of the parts
C1 = CMP-2000-05439-1: Chip Capacitor, 100 nF, +/- 10%, 16 V, -55 to 125 degC, 0402 (1005 Metric), RoHS, Tape and Reel; Manufacturer: Samsung Electro-Mechanics; Capacitance: 100000pF; Dielectric: X7R; Rated Voltage: 16V; Case Size/Dimension: 0402; Tolerance (%): ±10%; Manufacturer URL: http://www.samsungsem.com/global/index.jsp; Datasheet URL: https://datasheet.ciiva.com/29198/458718-da-01-en-vs-kondensator-0402-29198423.pdf; Datasheet Version: Nov-10
C2 C3 = CMP-13271-000835-1: Cap Ceramic 2.2uF 16V X5R ±10% Pad SMD 0603 +85°C T/R; Case Code (Metric): 1608; Height: 0.8mm; Case/Package: 0603; Depth: 0.8mm; Capacitance: 2.2uF; Voltage Rating: 16V; Case Code (Imperial): 0603; Length: 1.6mm; Packaging: Tape and Reel; Material: Ceramic; Lead Free: Lead Free; Max Operating Temperature: 85°C; Contact Plating: Tin; Thickness: 0.035inch; Radiation Hardening: No; Tolerance: 10%; Min Operating Temperature: -55°C; Voltage: 16V; Dielectric: X5R; Mount: Surface Mount; Package Quantity: 4000; Width: 0.031inch; Voltage Rating (DC): 16V
J2 J5 = CMP-17439-000122-1: CONN HEADER R/A 6POS 1.5MM; Body Plating: Tin; Contact Resistance: 30mR; Voltage Rating (DC): 50V; Number of Positions: 6; Current Rating: 1A; Panel Thickness: 3.5mm; Insulation Resistance: 500MR; Gender: Male; Lead Free: Lead Free; Contact Shape: Circular; Material: Nylon; Number of Rows: 1; Fastening Type: Detent; Number of Pins: 6; Color: White; Flammability Rating: UL94 V-0; Series: ZH; Depth: 6mm; Termination: Solder; Length: 10.5mm; Lead Pitch: 1.5mm; Min Operating Temperature: -25°C; Width: 3.5mm; Max Operating Temperature: 85°C; Contact Material: Brass; Packaging: Bulk; Insulation Material: Nylon; Height: 7.2mm; Voltage Rating: 50V; Mount: Through Hole; Contact Mating Length: 0.094inch; Max Current Rating: 1A; Insulation Color: Natural; Voltage Rating (AC): 50V; Contact Type: Male Pin; Contact Finish - Mating: TIN; Pitch: 1.5mm; Number of Contacts: 6; Housing Color: Beige; REACH SVHC: No SVHC; Connector Type: Header; Orientation: Right Angle; Max Voltage Rating (AC): 50V; Housing Material: Polyamide; Contact Plating: Tin
J16-J18 = CMP-2000-05181-2: as J8 on sheet CAN; Insulation Material: Nylon; Mount: Through Hole; RoHS Compliant: Yes; Series: THM; Height: 0.3inch; Termination: Through Hole; Material: Nylon; Packaging: Bulk; Contact Material: Bronze; REACH SVHC: No SVHC; Contact Plating: Silver; Orientation: Straight; Lead Free: Lead Free; Package Quantity: 100; Length: 7.62mm; Flammability Rating: UL94 V-0; Number of Contacts: 1; Diameter: 2.54mm; Housing Color: Black; Color: Black
R35-R37 = CMP-2002-05884-2: NexarPartId: 9251384; Voltage Rating (DC): 25V; Temperature Coefficient: 25ppm/°C; Tolerance: 0.1%; Resistance: 3.3kΩ; Power Rating: 63mW; Case/Package: 0402; Number of Terminations: 2; Military Standard: Not; Case Code (Imperial): 0402; Length: 1mm; Contact Plating: Tin; Termination: SMD/SMT; Schedule B: 8533210045, 8533210045; Voltage Rating: 25V; Lead Free: Lead Free; Min Operating Temperature: -55°C; REACH SVHC: No SVHC; Max Power Dissipation: 63mW; Weight: 793.786648µg; RoHS: Compliant; Depth: 500µm; Packaging: Cut Tape; Max Operating Temperature: 155°C; Width: 500µm; Case Code (Metric): 1005; Height: 350µm; Composition: Thin Film; Lifecycle Status: Production; Radiation Hardening: No; Number of Pins: 2; Mount: Surface Mount
R38 R40 R42 = CMP-2002-00433-1: Manufacturer: Panasonic; Part Number: ERJ-2GEJ103X
R39 R41 R43 = CMP-2002-00759-4: RES SMD 20K OHM 1% 1/10W 0402; Resistance: 20kR; Voltage Rating (DC): 50V; Power Rating: 100mW; Temperature Coefficient: 100ppm/°C; Radiation Hardening: No; Case/Package: 0402; Case Code (Metric): 1005; Min Operating Temperature: -55°C; Termination: SMD/SMT; Package Quantity: 1; Length: 1mm; Case Code (Imperial): 0402; Lead Free: Lead Free; Height: 0.35mm; Max Operating Temperature: 155°C; Depth: 0.5mm; Number of Terminations: 2; Military Standard: Not; Max Power Dissipation: 100mW; Tolerance: 1%; Composition: Thick Film; Weight: 2.8E-05oz; Features: Automotive AEC-Q200; Voltage Rating: 50V; Contact Plating: Tin; REACH SVHC: No SVHC; Width: 0.02inch; Packaging: Cut Tape; Mount: Surface Mount
U1 = STM32G473VET6: BOM_Manufacturer: ST(意法半导体); Contributor: LCSC; BOM_Supplier: LCSC; BOM_Supplier Part: C730122; BOM_Manufacturer Part: STM32G473VET6; BOM_JLCPCB Part Class: Extended Part; spicePre: U; spiceSymbolName: STM32G473VET6

## Sheet DRV8301.SchDoc
size A3; SheetNumber: 4; SheetTotal: 5
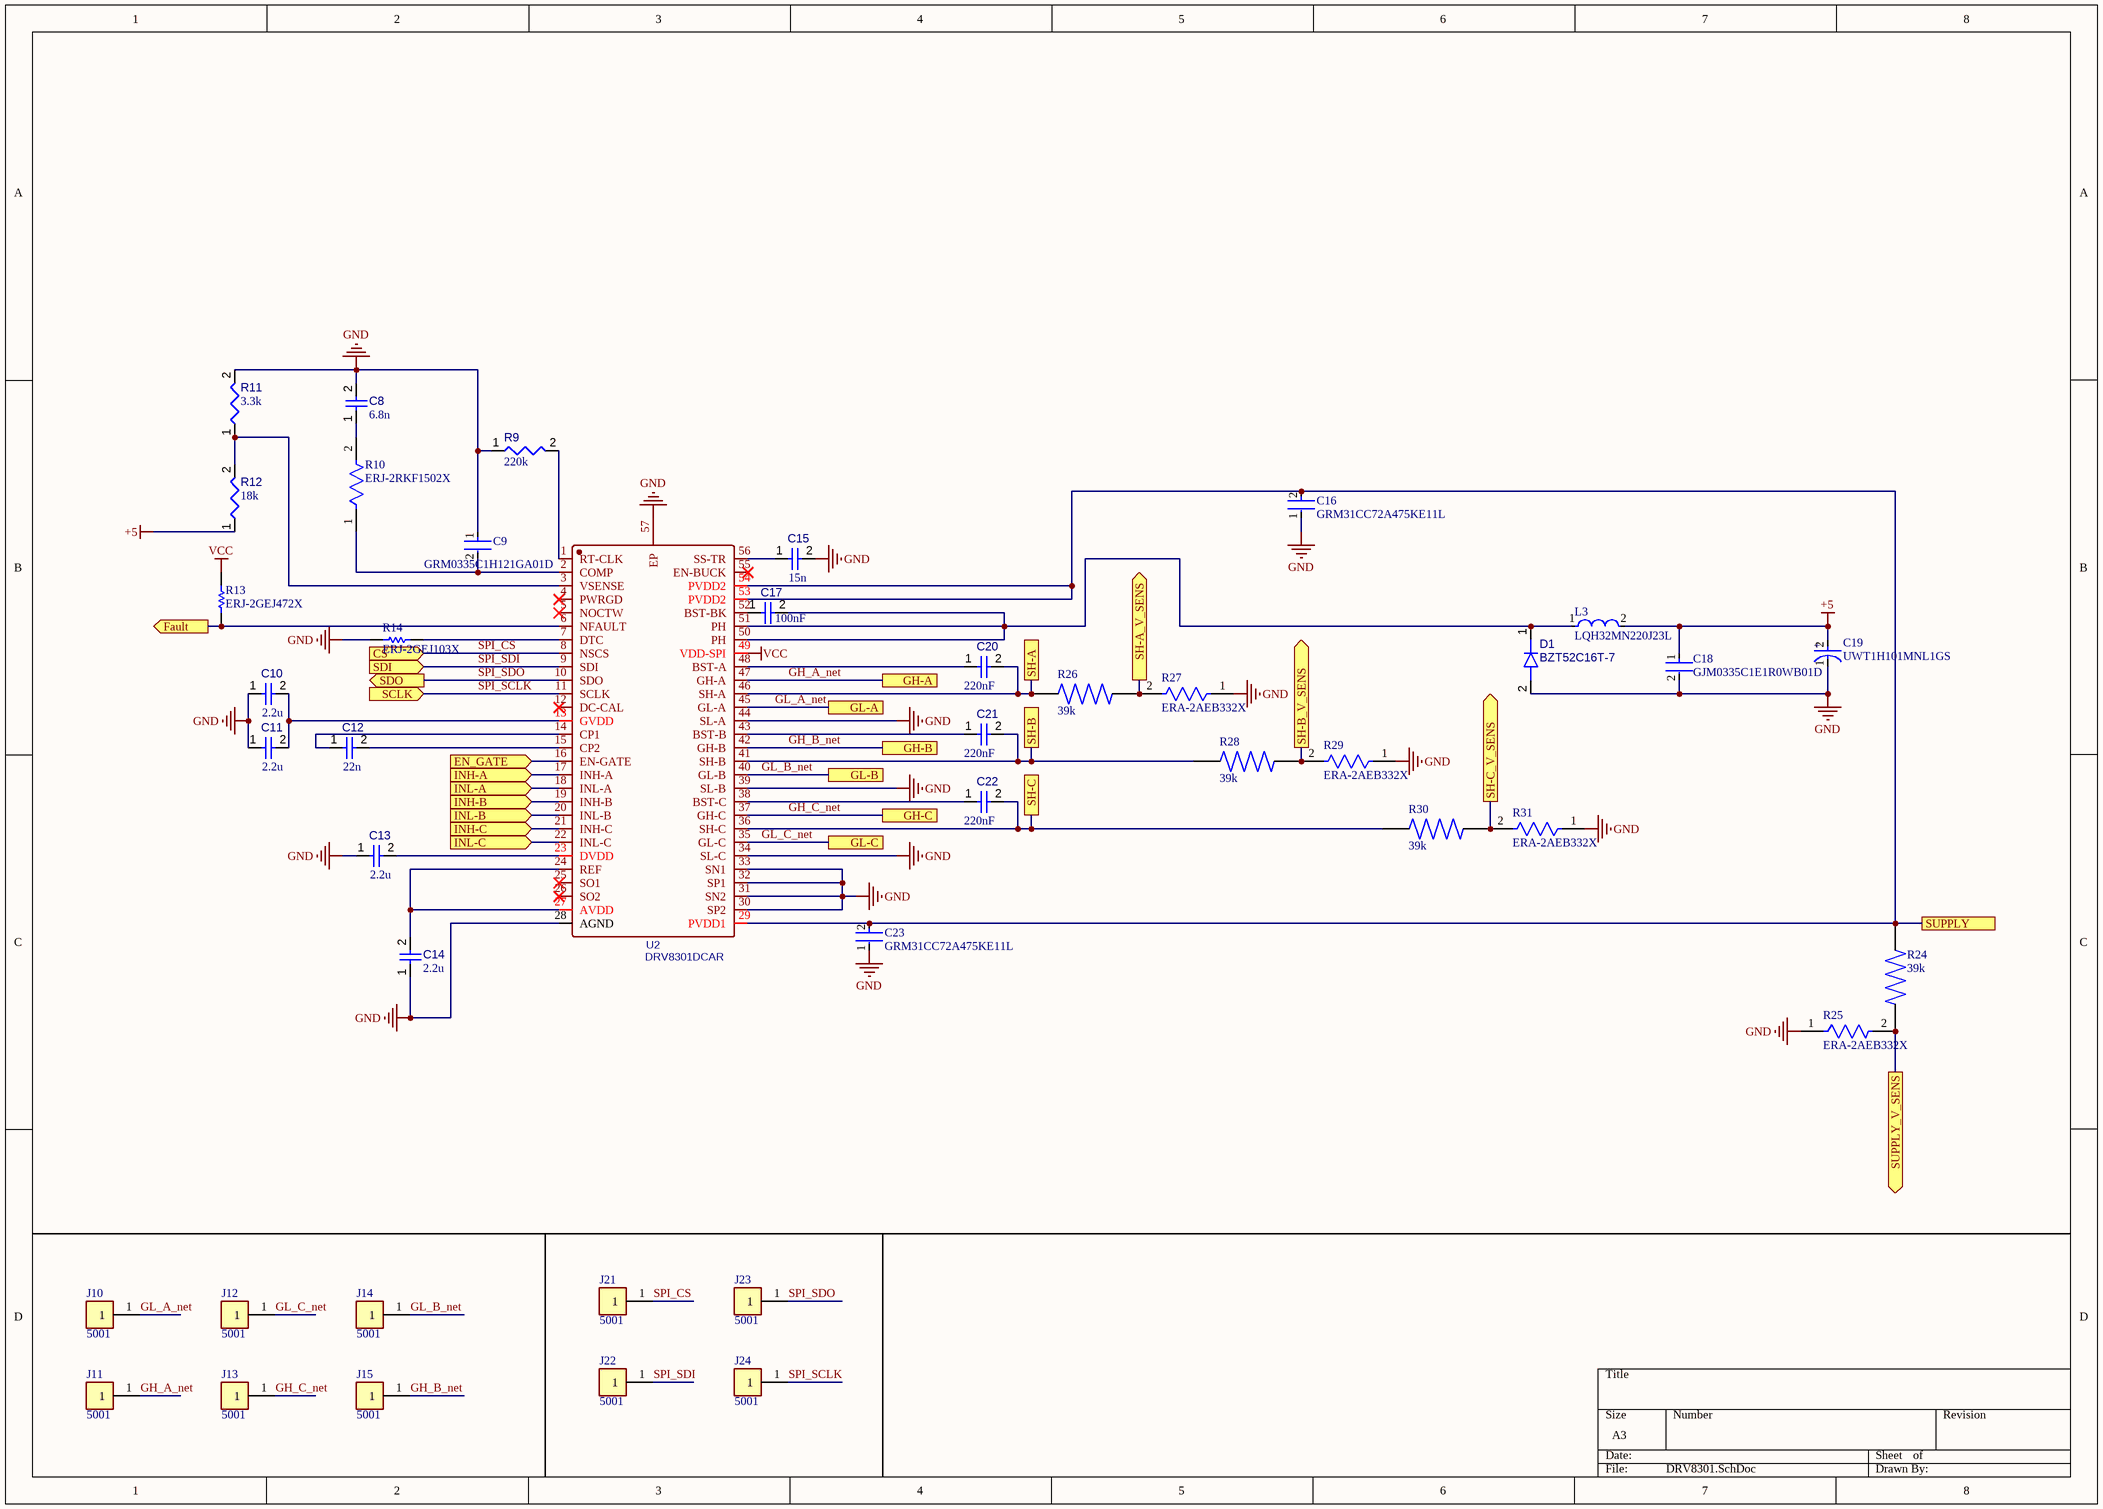
[diagram p4: DRV8301.SchDoc]

### Parts
C8  value 6.8n  [CAP-0402]  (hidden comment: C0402C682K5RECAUTO)
C9  GRM0335C1H121GA01D  [FP-GRM033-0_03-IPC_A]
C10  value 2.2u  [CAP-0805]  (hidden comment: C0805C225J4REC7800)
C11  value 2.2u  [CAP-0805]  (hidden comment: C0805C225J4REC7800)
C12  value 22n  [CAP-0402]  (hidden comment: C0402C223K5RECAUTO)
C13  value 2.2u  [CAP-0805]  (hidden comment: C0805C225J4REC7800)
C14  value 2.2u  [CAP-0805]  (hidden comment: C0805C225J4REC7800)
C15  value 15n  [CAP-0402]  (hidden comment: C0402C153J5REC7867)
C16  GRM31CC72A475KE11L  [FP-GRM31C-0_3-e0_3_0_9-MFG]
C17  value 100nF  [CAP-0805]  (hidden comment: MT05B104M500BD)
C18  GJM0335C1E1R0WB01D  [FP-GJM033-0_03-IPC_A]
C19  UWT1H101MNL1GS  [FP-UWT1H101MNL1GS-MFG]
C20  value 220nF  [CAP-0805]  (hidden comment: C0805C224J1REC7800)
C21  value 220nF  [CAP-0805]  (hidden comment: C0805C224J1REC7800)
C22  value 220nF  [CAP-0805]  (hidden comment: C0805C224J1REC7800)
C23  GRM31CC72A475KE11L  [FP-GRM31C-0_3-e0_3_0_9-MFG]
D1  BZT52C16T-7  [SODFL160X65-2N]
J10  5001  [FP-5001-MFG]
J11  5001  [FP-5001-MFG]
J12  5001  [FP-5001-MFG]
J13  5001  [FP-5001-MFG]
J14  5001  [FP-5001-MFG]
J15  5001  [FP-5001-MFG]
J21  5001  [FP-5001-MFG]
J22  5001  [FP-5001-MFG]
J23  5001  [FP-5001-MFG]
J24  5001  [FP-5001-MFG]
L3  LQH32MN220J23L  [FP-LQH32CH_23-MFG]
R9  value 220k  [CAP-0603]  (hidden comment: WR06X2203FTL)
R10  ERJ-2RKF1502X  [FP-ERJ2R-MFG]
R11  value 3.3k  [CAP-0603]  (hidden comment: RMCF0603FT3K30)
R12  value 18k  [CAP-0603]  (hidden comment: RMCF0603FT18K0)
R13  ERJ-2GEJ472X  [RESC1005X40X25LL05T05]
R14  ERJ-2GEJ103X  [RESC1005X40X25ML05T05]
R24  value 39k  [RESC6332X120N]  (hidden comment: 352239KJT)
R25  ERA-2AEB332X  [FP-ERA2A-MFG]
R26  value 39k  [RESC6332X120N]  (hidden comment: 352239KJT)
R27  ERA-2AEB332X  [FP-ERA2A-MFG]
R28  value 39k  [RESC6332X120N]  (hidden comment: 352239KJT)
R29  ERA-2AEB332X  [FP-ERA2A-MFG]
R30  value 39k  [RESC6332X120N]  (hidden comment: 352239KJT)
R31  ERA-2AEB332X  [FP-ERA2A-MFG]
U2  DRV8301DCAR  [IC-HTSSOP-56-THERM]

### Ports
CS (in), EN_GATE (in), Fault (out), GH-A, GH-B, GH-C, GL-A, GL-B, GL-C, INH-A (in), INH-B (in), INH-C (in), INL-A (in), INL-B (in), INL-C (in), SCLK (in), SDI (in), SDO (out), SH-A, SH-A_V_SENS (out), SH-B, SH-B_V_SENS (out), SH-C, SH-C_V_SENS (out), SUPPLY, SUPPLY_V_SENS (out)

### Nets
+5: C18.1 C19.2(A) L3.2 R12.1
GND: C8.2 C9.1 C10.1 C11.1 C13.1 C14.1 C15.2 C16.1 C18.2 C19.1(C) C23.1 D1.2(A) R9.1 R11.2 R14.1 R25.1 R27.1 R29.1 R31.1 U2.28(AGND) U2.30(SP2) U2.31(SN2) U2.32(SP1) U2.33(SN1) U2.34(SL-C) U2.39(SL-B) U2.44(SL-A) U2.57(EP)
VCC: R13.2 U2.49(VDD-SPI)
GH_A_net: J11.1 U2.47(GH-A) ; port GH-A
GH_B_net: J15.1 U2.42(GH-B) ; port GH-B
GH_C_net: J13.1 U2.37(GH-C) ; port GH-C
GL_A_net: J10.1 U2.45(GL-A) ; port GL-A
GL_B_net: J14.1 U2.40(GL-B) ; port GL-B
GL_C_net: J12.1 U2.35(GL-C) ; port GL-C
SPI_CS: J21.1 U2.8(NSCS) ; port CS
SPI_SCLK: J24.1 U2.11(SCLK) ; port SCLK
SPI_SDI: J22.1 U2.9(SDI) ; port SDI
SPI_SDO: J23.1 U2.10(SDO) ; port SDO
SUPPLY_NET: C16.2 C23.2 R24.1 U2.29(PVDD1) U2.53(PVDD2) U2.54(PVDD2) ; port SUPPLY
NetC8_1: C8.1 R10.2
NetC9_2: C9.2 R10.1 U2.2(COMP)
NetC10_2: C10.2 C11.2 U2.13(GVDD)
NetC12_1: C12.1 U2.14(CP1)
NetC12_2: C12.2 U2.15(CP2)
NetC13_2: C13.2 U2.23(DVDD)
NetC14_2: C14.2 U2.24(REF) U2.27(AVDD)
NetC15_1: C15.1 U2.56(SS-TR)
NetC17_1: C17.1 U2.52(BST-BK)
NetC17_2: C17.2 D1.1(K) L3.1 U2.50(PH) U2.51(PH)
NetC20_1: C20.1 U2.48(BST-A)
NetC20_2: C20.2 R26.1 U2.46(SH-A) ; port SH-A
NetC21_1: C21.1 U2.43(BST-B)
NetC21_2: C21.2 R28.1 U2.41(SH-B) ; port SH-B
NetC22_1: C22.1 U2.38(BST-C)
NetC22_2: C22.2 R30.1 U2.36(SH-C) ; port SH-C
NetR9_2: R9.2 U2.1(RT-CLK)
NetR11_1: R11.1 R12.2 U2.3(VSENSE)
NetR13_1: R13.1 U2.6(NFAULT) ; port Fault
NetR14_2: R14.2 U2.7(DTC)
NetR24_2: R24.2 R25.2 ; port SUPPLY_V_SENS
NetR26_2: R26.2 R27.2 ; port SH-A_V_SENS
NetR28_2: R28.2 R29.2 ; port SH-B_V_SENS
NetR30_2: R30.2 R31.2 ; port SH-C_V_SENS
NetU1_82: U2.17(INH-A) ; port INH-A
NetU1_83: U2.19(INH-B) ; port INH-B
NetU1_84: U2.21(INH-C) ; port INH-C
NetU1_85: U2.18(INL-A) ; port INL-A
NetU1_86: U2.20(INL-B) ; port INL-B
NetU1_87: U2.22(INL-C) ; port INL-C
NetU1_88: U2.16(EN-GATE) ; port EN_GATE

Not connected (* = marked no-connect by the designer): U2 4(PWRGD)* 5(NOCTW)* 12(DC-CAL)* 25(SO1)* 26(SO2)* 55(EN-BUCK)*

### Notes on the sheet
- (in symbol CMP-2000-07373-2) +

### Library data of the parts
C8 = CMP-001-00086-1: Ceramic Capacitor, Multilayer, Ceramic, 50V, 10% +Tol, 10% -Tol, X7R, 15% TC, 0.0068uF, Surface Mount, 0402; Capacitor Type: Ceramic; Case/Package: 0402; Pins: 2; RoHS Compliant: Yes
C9 = CMP-06035-001982-1: Chip Multilayer Ceramic Capacitors for General Purpose, 0201, 120pF, C0G, 30ppm/°C, 2%, 50V; Case/Package: 0201; Capacitance: 120pF; Case Code (Metric): 0603; Case Code (Imperial): 0201; Weight: 1.2E-05oz; Max Operating Temperature: 125°C; Dielectric: C0G; Width: 0.3mm; Thickness: 300um; Package Quantity: 15000; Min Operating Temperature: -55°C; Height: 0.3mm; Termination: SMD/SMT; Length: 0.6mm; Tolerance: 2%; Packaging: Tape and Reel; Resistor Type: Ceramic; Voltage Rating (DC): 50V
C10 C11 C13 C14 = CMP-001-00084-1: as C24 on sheet Power
C12 = CMP-001-00085-1: Ceramic Capacitor, Multilayer, Ceramic, 50V, 10% +Tol, 10% -Tol, X7R, 15% TC, 0.022uF, Surface Mount, 0402; RoHS Compliant: Yes; Pins: 2; Case/Package: 0402; Capacitor Type: Ceramic
C15 = CMP-001-00087-1: Ceramic Capacitor, Multilayer, Ceramic, 50V, 5% +Tol, 5% -Tol, X7R, 15% TC, 0.015uF, Surface Mount, 0402; RoHS Compliant: Yes; Case/Package: 0402
C16 C23 = CMP-06035-000119-2: Chip Multilayer Ceramic Capacitors for General Purpose, 1206, 4.7uF, X7S, 22%, 10%, 100V
C17 = CMP-001-00088-1: Cap. SMD, 0805, X7R, 100nF, 20%, 50V,
C18 = CMP-2010-00803-2: as C7 on sheet CAN; Packaging: Tape and Reel; Lead Free: Lead Free; Voltage Rating (DC): 25V; Termination: SMD/SMT; Capacitance: 1pF; Height: 0.3mm; Case Code (Imperial): 0201; Thickness: 0.013inch; Max Operating Temperature: 125°C; Length: 0.6mm; Case/Package: 0201; Voltage Rating: 25V; Case Code (Metric): 0603; Radiation Hardening: No; Width: 0.3mm; Min Operating Temperature: -55°C; Mount: Surface Mount; Package Quantity: 15000; Depth: 0.3mm; Dielectric: C0G
C19 = CMP-2000-07373-2: as C26 on sheet Power; Termination: SMD/SMT; Tolerance: 20%; Package Quantity: 500; Capacitance: 100uF; Height: 10mm; REACH SVHC: No SVHC; Case/Package: Radial; Series: WT; Diameter: 8mm; Voltage Rating: 50V; Construction: Cylindrical; Length: 10mm; Min Operating Temperature: -55°C; Max Operating Temperature: 105°C; Voltage Rating (DC): 50V; Packaging: Tape and Reel; Voltage: 50V; Mount: Surface Mount; Ripple Current (AC): 140mA; Radiation Hardening: No; Number of Pins: 2; Lead Free: Lead Free; Height - Seated (Max): 0.413inch; RoHS Compliant: Yes
C20-C22 = CMP-001-00089-1: Cap Ceramic 0.22uF 100V X7R 5% SMD 0805 125°C T/R; Case/Package: 0805
D1 = CMP-004-00031-1: Zener Diode, 16V V(Z), 5.56%, 0.3W, Silicon, Unidirectional; Min Operating Temperature: -65°C; RoHS Compliant: Yes; Pins: 2; Max Operating Temperature: 150°C
J10-J15 J21-J24 = CMP-2000-05181-2: as J8 on sheet CAN; Insulation Material: Nylon; Mount: Through Hole; RoHS Compliant: Yes; Series: THM; Height: 0.3inch; Termination: Through Hole; Material: Nylon; Packaging: Bulk; Contact Material: Bronze; REACH SVHC: No SVHC; Contact Plating: Silver; Orientation: Straight; Lead Free: Lead Free; Package Quantity: 100; Length: 7.62mm; Flammability Rating: UL94 V-0; Number of Contacts: 1; Diameter: 2.54mm; Housing Color: Black; Color: Black
L3 = CMP-06042-014813-2: Wire Wound Ferrite Inductor for General Circuits 22μH ±5% 2.8Ω 150mA 1210; Inductance: 22uH; DC Resistance (DCR): 2.8R; Shielding: Unshielded; Self Resonant Frequency: 14MHz; Test Frequency: 1MHz; Q Factor: 35; RoHS Compliant: Yes; Core Material: Ferrite; Weight: 0.002116oz; Mount: Surface Mount; Min Operating Temperature: -40°C; Lead Free: Lead Free; Height - Seated (Max): 0.087inch; Width: 0.098inch; Max Operating Temperature: 85°C; REACH SVHC: No SVHC; Radiation Hardening: No; Length: 3.5mm; DC Current: 150mA; Packaging: Tape and Reel; Package Quantity: 2000; Inductance Tolerance: 5%; Resistor Type: Wirewound; Case/Package: 1210; Termination: SMD/SMT; Series: LQH32M; Current Rating: 150mA; Depth: 2.7mm; Tolerance: 5%; Max DC Current: 150mA; Military Standard: Not; Height: 2mm; Rated Current-Max: 150mA; Case Code (Imperial): 1210; Case Code (Metric): 3225
R9 = CMP-009-00179-1: Fixed Resistor, Metal Glaze/thick Film, 0.1W, 220000ohm, 75V, 1% +/-Tol, 100ppm/Cel, Surface Mount, 0603; Power: 100mW; Min Operating Temperature: -55°C; Max Operating Temperature: 155°C; Case/Package: 0603; RoHS Compliant: Yes; Tolerance: 1%; Pins: 2; Mounting Technology: Surface Mount
R10 = CMP-2002-00694-4: RES SMD 15K OHM 1% 1/10W 0402; Manufacturer: Panasonic; Automotive Grade: Grade 0; Voltage Rating: 50V; Resistance: 15kΩ; Temperature Coefficient: 100ppm/°C; Power Rating: 0.1W; Value: 15kΩ; ComponentLink2URL: https://industrial.panasonic.com/cdbs/www-data/pdf/RDA0000/AOA0000C304.pdf; Automotive: Yes; Temperature: -55°C to +155°C; Height: 0.4mm; Digikey Description: RES SMD 15K OHM 1% 1/10W 0402; Category: Res; Device Class L2: Resistors; Device Class L1: Passive Components; Package: ERJ2R; Temperature Range Low: -55°C; Tolerance: 1%; Series: ERJ; Manufacturer Part Number: ERJ-2RKF1502X; Footprint Url: https://b2b-api.panasonic.eu/file_stream/pids/fileversion/1180; Mouser Description: Res Thick Film 1.0 x 0.5 mm 15K Ohm 1% 0.1W(1/10W) 100ppm/ C Molded SMD Punched Carrier T/R; Composition: Thick Film; Lead Free: Yes; Device Class L3: Chip SMD Resistors; Octopart: https://octopart.com/erj-2rkf1502x-panasonic-55404985; RoHS: TRUE; Temperature Range High: +155°C; ComponentLink2Description: Datasheet
R11 = CMP-009-00177-1: Fixed Resistor, Metal Glaze/thick Film, 0.1W, 3300ohm, 75V, 1% +/-Tol, 100ppm/Cel, Surface Mount, 0603; Power: 100mW; Min Operating Temperature: -55°C; Mounting Technology: Surface Mount; Tolerance: 1%; Case/Package: 0603; Max Operating Temperature: 155°C; RoHS Compliant: Yes; Pins: 2
R12 = CMP-009-00178-1: Fixed Resistor, Metal Glaze/thick Film, 0.1W, 18000ohm, 75V, 1% +/-Tol, 100ppm/Cel, Surface Mount, 0603; Power: 100mW; Max Operating Temperature: 155°C; Case/Package: 0603; Tolerance: 1%; Pins: 2; Mounting Technology: Surface Mount; Min Operating Temperature: -55°C; RoHS Compliant: Yes
R13 = CMP-2002-00544-1: Manufacturer: Panasonic; Part Number: ERJ-2GEJ472X
R14 = CMP-2002-00433-1: Manufacturer: Panasonic; Part Number: ERJ-2GEJ103X
R24 R26 R28 R30 = CMP-009-00181-1: 3522 39K 5% 3W; Design Item ID: 352239KJT; MP: 352239KJT; Pins: 2; Case/Package: None; Price: None; Availability: Unavailable; Source: 352239KJT.SchLib; Component Type: Standard
R25 R27 R29 R31 = CMP-2002-05884-2: as R35 on sheet MCU schematic; Case/Package: 0402; Number of Terminations: 2; Military Standard: Not; Case Code (Imperial): 0402; Length: 1mm; Contact Plating: Tin; Termination: SMD/SMT; Schedule B: 8533210045, 8533210045; Voltage Rating: 25V; Lead Free: Lead Free; Min Operating Temperature: -55°C; REACH SVHC: No SVHC; Max Power Dissipation: 63mW; Weight: 793.786648µg; RoHS: Compliant; Depth: 500µm; Packaging: Cut Tape; Max Operating Temperature: 155°C; Width: 500µm; Case Code (Metric): 1005; Height: 350µm; Composition: Thin Film; Lifecycle Status: Production; Radiation Hardening: No; Number of Pins: 2; Mount: Surface Mount
U2 = DRV8301DCAR: BOM_Manufacturer: TI(德州仪器); Contributor: LCSC; BOM_Supplier: LCSC; BOM_Supplier Part: C98969; BOM_Manufacturer Part: DRV8301DCAR; BOM_JLCPCB Part Class: Extended Part; spicePre: U; spiceSymbolName: DRV8301DCAR

## Nets that join several sheets
+5: Power (C24.1 J20.1 U6.1 U6.3), MCU schematic (J5.1 R35.1 R36.1 R37.1), DRV8301 (C18.1 C19.2 L3.2 R12.1)
GND: CAN (7 pins), Power (26 pins), MCU schematic (15 pins), DRV8301 (28 pins)
VCC: CAN (C4.1 C5.1 U7.3), Power (11 pins), MCU schematic (11 pins), DRV8301 (R13.2 U2.49)
GH_A_net: Power (R17.1), DRV8301 (J11.1 U2.47)
GH_B_net: Power (R20.1), DRV8301 (J15.1 U2.42)
GH_C_net: Power (R23.1), DRV8301 (J13.1 U2.37)
GL_A_net: Power (R34.2), DRV8301 (J10.1 U2.45)
GL_B_net: Power (R33.2), DRV8301 (J14.1 U2.40)
GL_C_net: Power (R32.2), DRV8301 (J12.1 U2.35)
NetC20_2: Power (Q_HA.2 Q_LA.3 R16.1 U5.8), DRV8301 (C20.2 R26.1 U2.46)
NetC21_2: Power (Q_HB.2 Q_LB.3 R19.1 U4.8), DRV8301 (C21.2 R28.1 U2.41)
NetC22_2: Power (Q_HC.2 Q_LC.3 R22.1 U3.8), DRV8301 (C22.2 R30.1 U2.36)
NetC29_1: Power (C29.1 R15.1), MCU schematic (U1.15)
NetC30_1: Power (C30.1 R18.1), MCU schematic (U1.16)
NetC31_1: Power (C31.1 R21.1), MCU schematic (U1.17)
NetR4_1: CAN (R4.1), MCU schematic (U1.52)
NetR5_1: CAN (R5.1), MCU schematic (U1.51)
NetR8_1: CAN (R8.1), MCU schematic (U1.62)
NetR13_1: MCU schematic (U1.89), DRV8301 (R13.1 U2.6)
NetR24_2: MCU schematic (U1.25), DRV8301 (R24.2 R25.2)
NetR26_2: MCU schematic (U1.20), DRV8301 (R26.2 R27.2)
NetR28_2: MCU schematic (U1.21), DRV8301 (R28.2 R29.2)
NetR30_2: MCU schematic (U1.22), DRV8301 (R30.2 R31.2)
NetU1_82: MCU schematic (U1.82), DRV8301 (U2.17)
NetU1_83: MCU schematic (U1.83), DRV8301 (U2.19)
NetU1_84: MCU schematic (U1.84), DRV8301 (U2.21)
NetU1_85: MCU schematic (U1.85), DRV8301 (U2.18)
NetU1_86: MCU schematic (U1.86), DRV8301 (U2.20)
NetU1_87: MCU schematic (U1.87), DRV8301 (U2.22)
NetU1_88: MCU schematic (U1.88), DRV8301 (U2.16)
SPI_CS: MCU schematic (U1.78), DRV8301 (J21.1 U2.8)
SPI_SCLK: MCU schematic (U1.79), DRV8301 (J24.1 U2.11)
SPI_SDI: MCU schematic (U1.81), DRV8301 (J22.1 U2.9)
SPI_SDO: MCU schematic (U1.80), DRV8301 (J23.1 U2.10)
SUPPLY_NET: Power (13 pins), DRV8301 (6 pins)